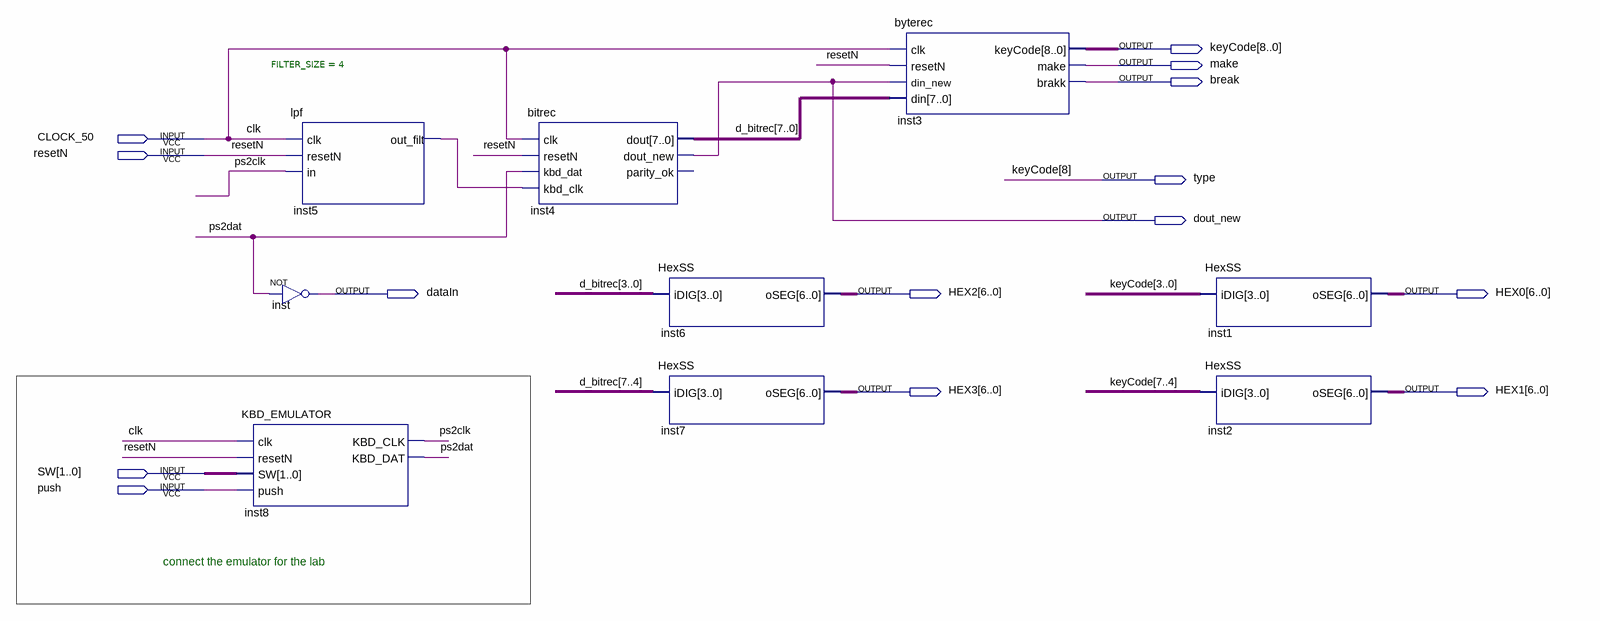
[diagram p0: schematic sheet]
// Quartus schematic TOP_KBDINTF.bdf as structural Verilog: 9 symbols, 14 pins
module TOP_KBDINTF (
  input  CLOCK_50,
  input  resetN,
  input  [1:0] SW,
  input  push,
  output [8:0] keyCode,
  output make,
  output \break ,
  output \type ,
  output dout_new,
  output dataIn,
  output [6:0] HEX2,
  output [6:0] HEX0,
  output [6:0] HEX3,
  output [6:0] HEX1
);

  wire inst5_out_filt, ps2clk, ps2dat;
  wire [7:0] d_bitrec;

  lpf #(.FILTER_SIZE(4)) inst5 (.clk(CLOCK_50), .resetN(resetN), .in(ps2clk), .out_filt(inst5_out_filt));
  not inst (dataIn, ps2dat);
  KBD_EMULATOR inst8 (.clk(CLOCK_50), .resetN(resetN), .SW(SW), .push(push), .KBD_CLK(ps2clk), .KBD_DAT(ps2dat));
  bitrec inst4 (
    .clk(CLOCK_50), .resetN(resetN), .kbd_dat(ps2dat), .kbd_clk(inst5_out_filt), .dout(d_bitrec),
    .dout_new(dout_new));  // open: parity_ok
  HexSS inst6 (.iDIG(d_bitrec[3:0]), .oSEG(HEX2));
  HexSS inst7 (.iDIG(d_bitrec[7:4]), .oSEG(HEX3));
  byterec inst3 (
    .clk(CLOCK_50), .resetN(resetN), .din_new(dout_new), .din(d_bitrec), .keyCode(keyCode), .make(make),
    .brakk(\break ));
  HexSS inst1 (.iDIG(keyCode[3:0]), .oSEG(HEX0));
  HexSS inst2 (.iDIG(keyCode[7:4]), .oSEG(HEX1));

  assign \type  = keyCode[8];

  // Other names for the same wires on the sheet: clk = CLOCK_50

  // Notes on the sheet:
  //   connect the emulator for the lab 
endmodule
